# Altium schematic sheet DRIVERS_CONNECTORS.SchDoc: LED Drivers
size B; Author: Sébastien Gélinas; Organization: SmartHalo; Address1: 5445 de Gaspé; Address2: Montréal, QC; Address3: Canada; Address4: H2T 3B2; Revision: 1; SheetNumber: 1; SheetTotal: 4
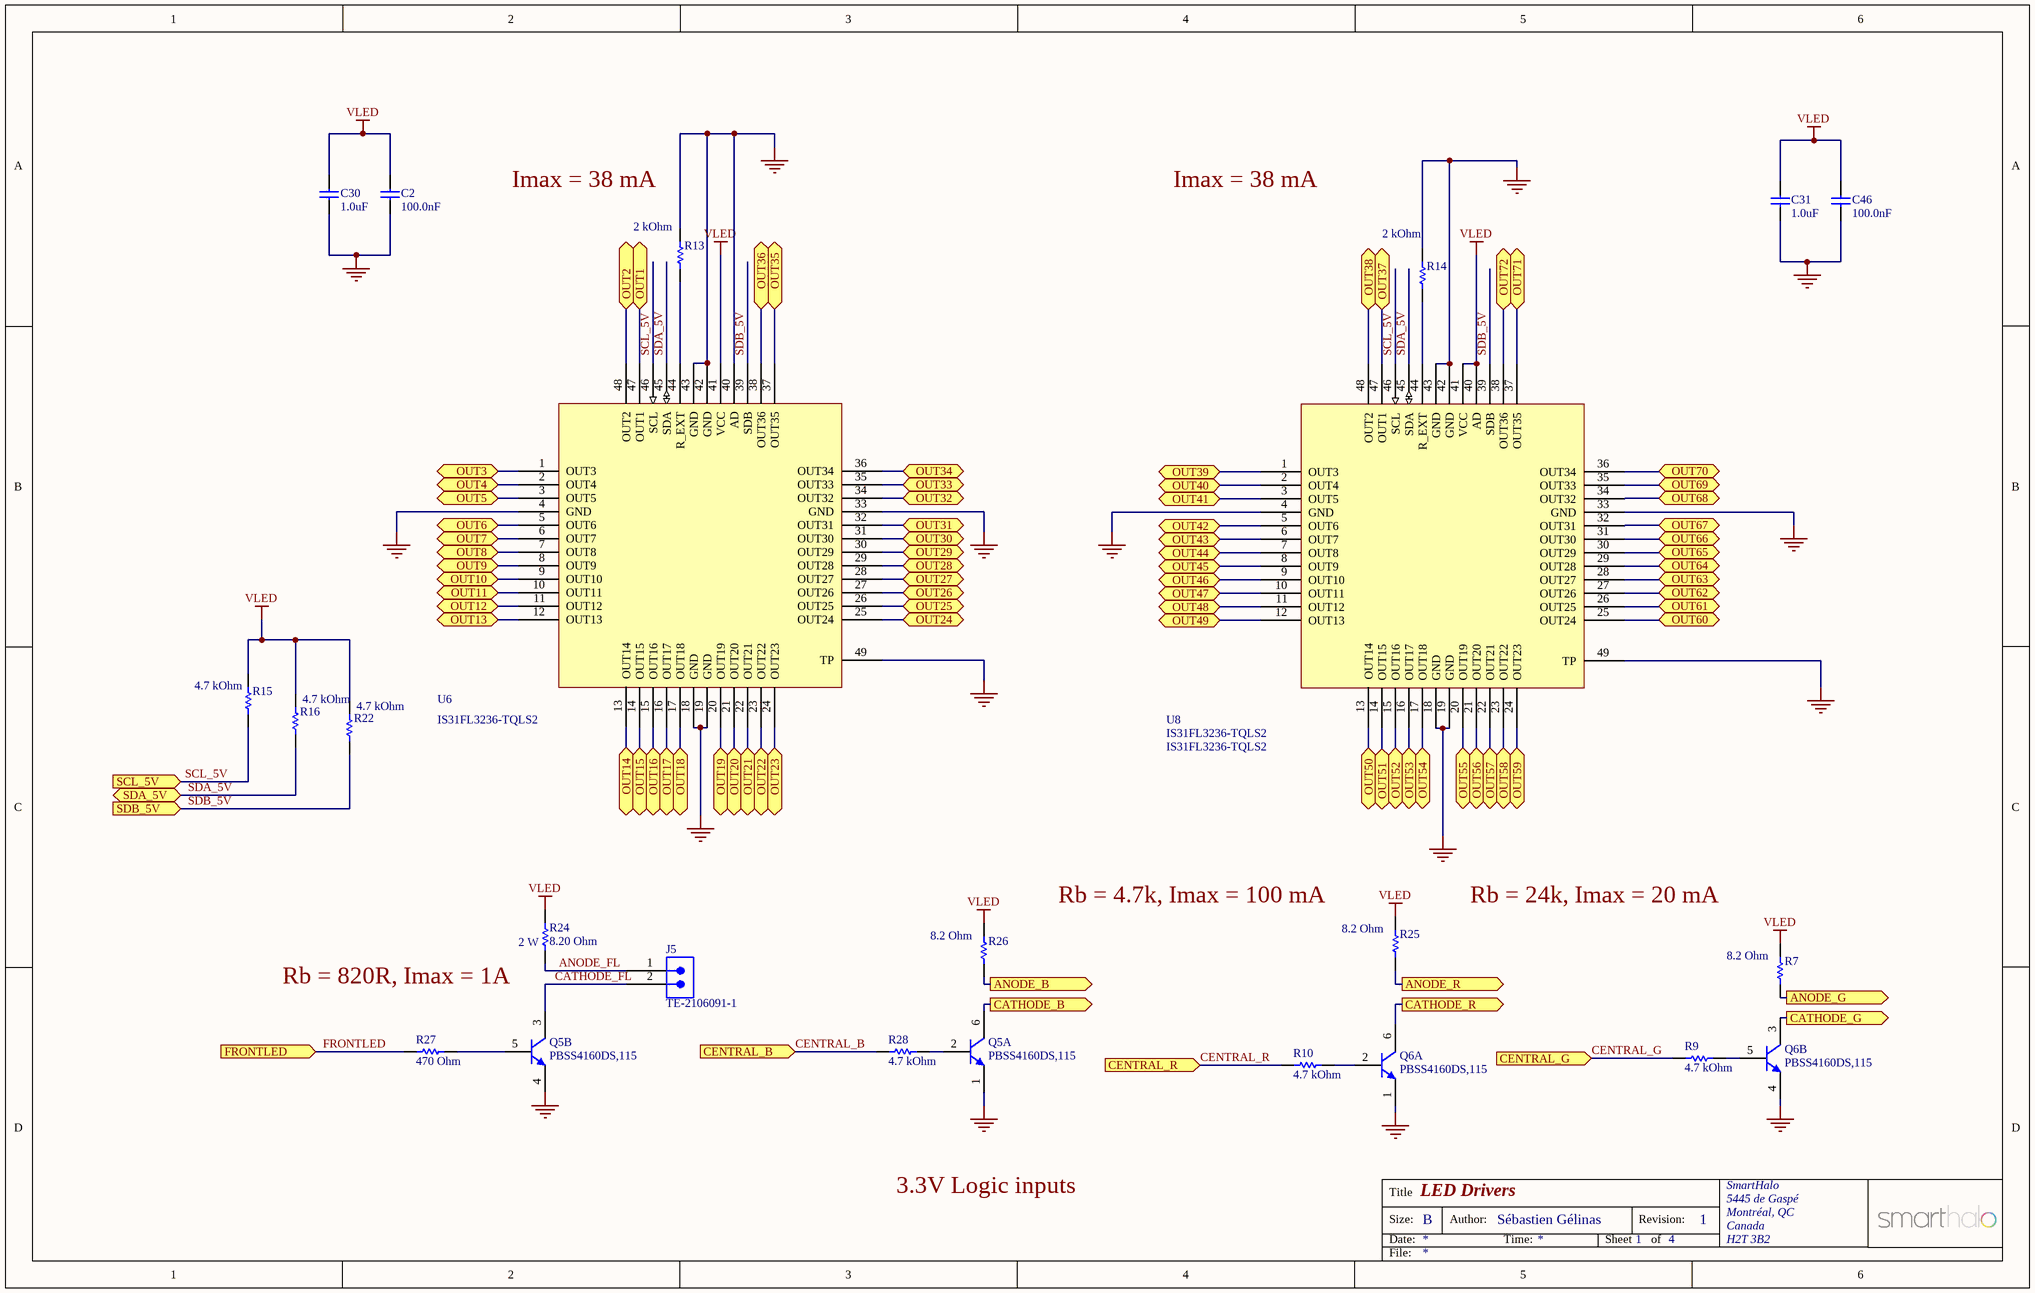
[diagram p0: DRIVERS_CONNECTORS.SchDoc]

## Parts
C2  100.0nF  [CAPC0603(1608)100_N]
C30  1.0uF  [CAPC0603(1608)100_N]
C31  1.0uF  [CAPC0603(1608)100_N]
C46  100.0nF  [CAPC0603(1608)100_N]
J5  TE-2106091-1  [TE-2106091-1]
Q5  PBSS4160DS,115  [NXP-SC74_M]  (parts A,B of 2)
Q6  PBSS4160DS,115  [NXP-SC74_M]  (parts A,B of 2)
R7  8.2 Ohm  [RESC0603(1608)_N]
R9  4.7 kOhm  [RESC0603(1608)_N]
R10  4.7 kOhm  [RESC0603(1608)_N]
R13  2 kOhm  [RESC0603(1608)_N]
R14  2 kOhm  [RESC0603(1608)_N]
R15  4.7 kOhm  [RESC0603(1608)_N]
R16  4.7 kOhm  [RESC0603(1608)_N]
R22  4.7 kOhm  [RESC0603(1608)_N]
R24  8.20 Ohm  Power: 2 W  [RESC2512(6432)_N]
R25  8.2 Ohm  [RESC0603(1608)_N]
R26  8.2 Ohm  [RESC0603(1608)_N]
R27  470 Ohm  [RESC0603(1608)_N]
R28  4.7 kOhm  [RESC0603(1608)_N]
U6  IS31FL3236-TQLS2  [TQFP48]
U8  IS31FL3236-TQLS2  [TQFP48]

## Ports
ANODE_B (out), ANODE_G (out), ANODE_R (out), CATHODE_B (out), CATHODE_G (out), CATHODE_R (out), CENTRAL_B (in), CENTRAL_G (in), CENTRAL_R (in), FRONTLED (in), OUT1, OUT2, OUT3, OUT4, OUT5, OUT6, OUT7, OUT8, OUT9, OUT10, OUT11, OUT12, OUT13, OUT14, OUT15, OUT16, OUT17, OUT18, OUT19, OUT20, OUT21, OUT22, OUT23, OUT24, OUT25, OUT26, OUT27, OUT28, OUT29, OUT30, OUT31, OUT32, OUT33, OUT34, OUT35, OUT36, OUT37, OUT38, OUT39, OUT40, OUT41, OUT42, OUT43, OUT44, OUT45, OUT46, OUT47, OUT48, OUT49, OUT50, OUT51, OUT52, OUT53, OUT54, OUT55, OUT56, OUT57, OUT58, OUT59, OUT60, OUT61, OUT62, OUT63, OUT64, OUT65, OUT66, OUT67, OUT68, OUT69, OUT70, OUT71, OUT72, SCL_5V (in), SDA_5V (bidir), SDB_5V (in)

## Nets
GND: C2.2 C30.2 C31.2 C46.2 Q5.1(E1) Q5.4(E2) Q6.1(E1) Q6.4(E2) R13.2 R14.2 U6.4(GND) U6.18(GND) U6.19(GND) U6.33(GND) U6.40(AD) U6.42(GND) U6.43(GND) U6.49(TP) U8.4(GND) U8.18(GND) U8.19(GND) U8.33(GND) U8.42(GND) U8.43(GND) U8.49(TP)
VLED: C2.1 C30.1 C31.1 C46.1 R7.2 R15.2 R16.2 R22.2 R24.2 R25.2 R26.2 U6.41(VCC) U8.40(AD) U8.41(VCC)
ANODE_B: R26.1 ; port ANODE_B
ANODE_FL: J5.1 R24.1
ANODE_G: R7.1 ; port ANODE_G
ANODE_R: R25.1 ; port ANODE_R
CATHODE_B: Q5.6(C1) ; port CATHODE_B
CATHODE_FL: J5.2 Q5.3(C2)
CATHODE_G: Q6.3(C2) ; port CATHODE_G
CATHODE_R: Q6.6(C1) ; port CATHODE_R
CENTRAL_B: R28.2 ; port CENTRAL_B
CENTRAL_G: R9.2 ; port CENTRAL_G
CENTRAL_R: R10.2 ; port CENTRAL_R
FRONTLED: R27.2 ; port FRONTLED
OUT1: U6.47(OUT1) ; port OUT1
OUT2: U6.48(OUT2) ; port OUT2
OUT3: U6.1(OUT3) ; port OUT3
OUT4: U6.2(OUT4) ; port OUT4
OUT5: U6.3(OUT5) ; port OUT5
OUT6: U6.5(OUT6) ; port OUT6
OUT7: U6.6(OUT7) ; port OUT7
OUT8: U6.7(OUT8) ; port OUT8
OUT9: U6.8(OUT9) ; port OUT9
OUT10: U6.9(OUT10) ; port OUT10
OUT11: U6.10(OUT11) ; port OUT11
OUT12: U6.11(OUT12) ; port OUT12
OUT13: U6.12(OUT13) ; port OUT13
OUT14: U6.13(OUT14) ; port OUT14
OUT15: U6.14(OUT15) ; port OUT15
OUT16: U6.15(OUT16) ; port OUT16
OUT17: U6.16(OUT17) ; port OUT17
OUT18: U6.17(OUT18) ; port OUT18
OUT19: U6.20(OUT19) ; port OUT19
OUT20: U6.21(OUT20) ; port OUT20
OUT21: U6.22(OUT21) ; port OUT21
OUT22: U6.23(OUT22) ; port OUT22
OUT23: U6.24(OUT23) ; port OUT23
OUT24: U6.25(OUT24) ; port OUT24
OUT25: U6.26(OUT25) ; port OUT25
OUT26: U6.27(OUT26) ; port OUT26
OUT27: U6.28(OUT27) ; port OUT27
OUT28: U6.29(OUT28) ; port OUT28
OUT29: U6.30(OUT29) ; port OUT29
OUT30: U6.31(OUT30) ; port OUT30
OUT31: U6.32(OUT31) ; port OUT31
OUT32: U6.34(OUT32) ; port OUT32
OUT33: U6.35(OUT33) ; port OUT33
OUT34: U6.36(OUT34) ; port OUT34
OUT35: U6.37(OUT35) ; port OUT35
OUT36: U6.38(OUT36) ; port OUT36
OUT37: U8.47(OUT1) ; port OUT37
OUT38: U8.48(OUT2) ; port OUT38
OUT39: U8.1(OUT3) ; port OUT39
OUT40: U8.2(OUT4) ; port OUT40
OUT41: U8.3(OUT5) ; port OUT41
OUT42: U8.5(OUT6) ; port OUT42
OUT43: U8.6(OUT7) ; port OUT43
OUT44: U8.7(OUT8) ; port OUT44
OUT45: U8.8(OUT9) ; port OUT45
OUT46: U8.9(OUT10) ; port OUT46
OUT47: U8.10(OUT11) ; port OUT47
OUT48: U8.11(OUT12) ; port OUT48
OUT49: U8.12(OUT13) ; port OUT49
OUT50: U8.13(OUT14) ; port OUT50
OUT51: U8.14(OUT15) ; port OUT51
OUT52: U8.15(OUT16) ; port OUT52
OUT53: U8.16(OUT17) ; port OUT53
OUT54: U8.17(OUT18) ; port OUT54
OUT55: U8.20(OUT19) ; port OUT55
OUT56: U8.21(OUT20) ; port OUT56
OUT57: U8.22(OUT21) ; port OUT57
OUT58: U8.23(OUT22) ; port OUT58
OUT59: U8.24(OUT23) ; port OUT59
OUT60: U8.25(OUT24) ; port OUT60
OUT61: U8.26(OUT25) ; port OUT61
OUT62: U8.27(OUT26) ; port OUT62
OUT63: U8.28(OUT27) ; port OUT63
OUT64: U8.29(OUT28) ; port OUT64
OUT65: U8.30(OUT29) ; port OUT65
OUT66: U8.31(OUT30) ; port OUT66
OUT67: U8.32(OUT31) ; port OUT67
OUT68: U8.34(OUT32) ; port OUT68
OUT69: U8.35(OUT33) ; port OUT69
OUT70: U8.36(OUT34) ; port OUT70
OUT71: U8.37(OUT35) ; port OUT71
OUT72: U8.38(OUT36) ; port OUT72
SCL_5V: R15.1 U6.46(SCL) U8.46(SCL) ; port SCL_5V
SDA_5V: R16.1 U6.45(SDA) U8.45(SDA) ; port SDA_5V
SDB_5V: R22.1 U6.39(SDB) U8.39(SDB) ; port SDB_5V
NetQ5_2: Q5.2(B1) R28.1
NetQ5_5: Q5.5(B2) R27.1
NetQ6_2: Q6.2(B1) R10.1
NetQ6_5: Q6.5(B2) R9.1
NetR13_1: R13.1 U6.44(R_EXT)
NetR14_1: R14.1 U8.44(R_EXT)

## Notes on the sheet
- (near R13) Imax = 38 mA
- Imax = 38 mA
- Rb = 4.7k, Imax = 100 mA
- Rb = 24k, Imax = 20 mA
- (near R24) Rb = 820R, Imax = 1A
- 3.3V Logic inputs
- Title
- Size:
- Date:
- B
- Author:
- Time:
- Sheet
- Revision:
- of
- File:

## Library data of the parts
C2 C30 C31 C46 = CAP0603: Chip Cap 0603 X7R 10%; Part Number: C0402-1n0; Note: Chip Cap X7R 10%; Artikkelnr Noca: 20039223; Published: 2009-05-08; LatestRevisionDate: 2009-11-23; Publisher: Nordic Semiconductor; Manufacturer: *; Manufacturer Part Number: *; Datasheet: *; Footprint: 0603; Pin Count: 2; Supplier: *
  C2 C46: Value: 100.0nF
  C30 C31: Value: 1.0uF
J5 = TE-2106091-1: 2 pos Inverted Thru Board SMT Header; Manufacturer: TE; Manufacturer Part Number: 2106091
Q5 Q6 = PBSS4160DS,115: TRANS 2NPN 60V 1A 6TSOP; Manufacturer: NXP Semiconductors; Polarity: NPN; Mounting Technology: Surface Mount; PackageDescription: 6-Pin Semiconductor Package, 2.9 x 1.6 mm Body, 0.95 mm Pitch; PackageReference: SC74; PartNumber: PBSS4160DS; Manufacturer Part Number: PBSS4160DS,115; Digi-Key Part Number: 568-4350-1-ND
R7 R25 R26 = CMP-1012-00090-1: 8R2 0.1W 5% 0603 (1608 Metric)  SMD; Case-Metric: 1608; Case-EIA: 0603; Tolerance: 5 %; Technology: SMT; Power: 0.1 W; Value: 8.2 Ohm
R9 R10 R15 R16 R22 R28 = CMP-1012-00090-1: 4K7 0.1W 5% 0603 (1608 Metric)  SMD; Case-Metric: 1608; Case-EIA: 0603; Tolerance: 5 %; Technology: SMT; Power: 0.1 W; Value: 4.7 kOhm
R13 R14 = CMP-1012-00090-1: 2k 0.1W 5% 0603 (1608 Metric)  SMD; Case-Metric: 1608; Case-EIA: 0603; Tolerance: 5 %; Technology: SMT; Power: 0.1 W; Value: 2 kOhm
R24 = CMP-1018-00024-1: 8R2 2W 5% 2512 (6432 Metric)  SMD; Case-Metric: 6432; Case-EIA: 2512; Value: 8.20 Ohm; Tolerance: 5 %; Technology: SMT
R27 = CMP-1012-00090-1: 470R 1/16W 5% 0603 (1608 Metric)  SMD; Case-Metric: 1608; Case-EIA: 0603; Tolerance: 5 %; Technology: SMT; Power: 1/16 W; Value: 470 Ohm
U6 U8 = IS31FL3236-TQLS2: IC 36 CHANNELS LED DRIVER; Manufacturer: ISSI; Manufacturer Part Number: IS31FL3236-TQLS2